# Altium project PCB_Working.PrjPcb
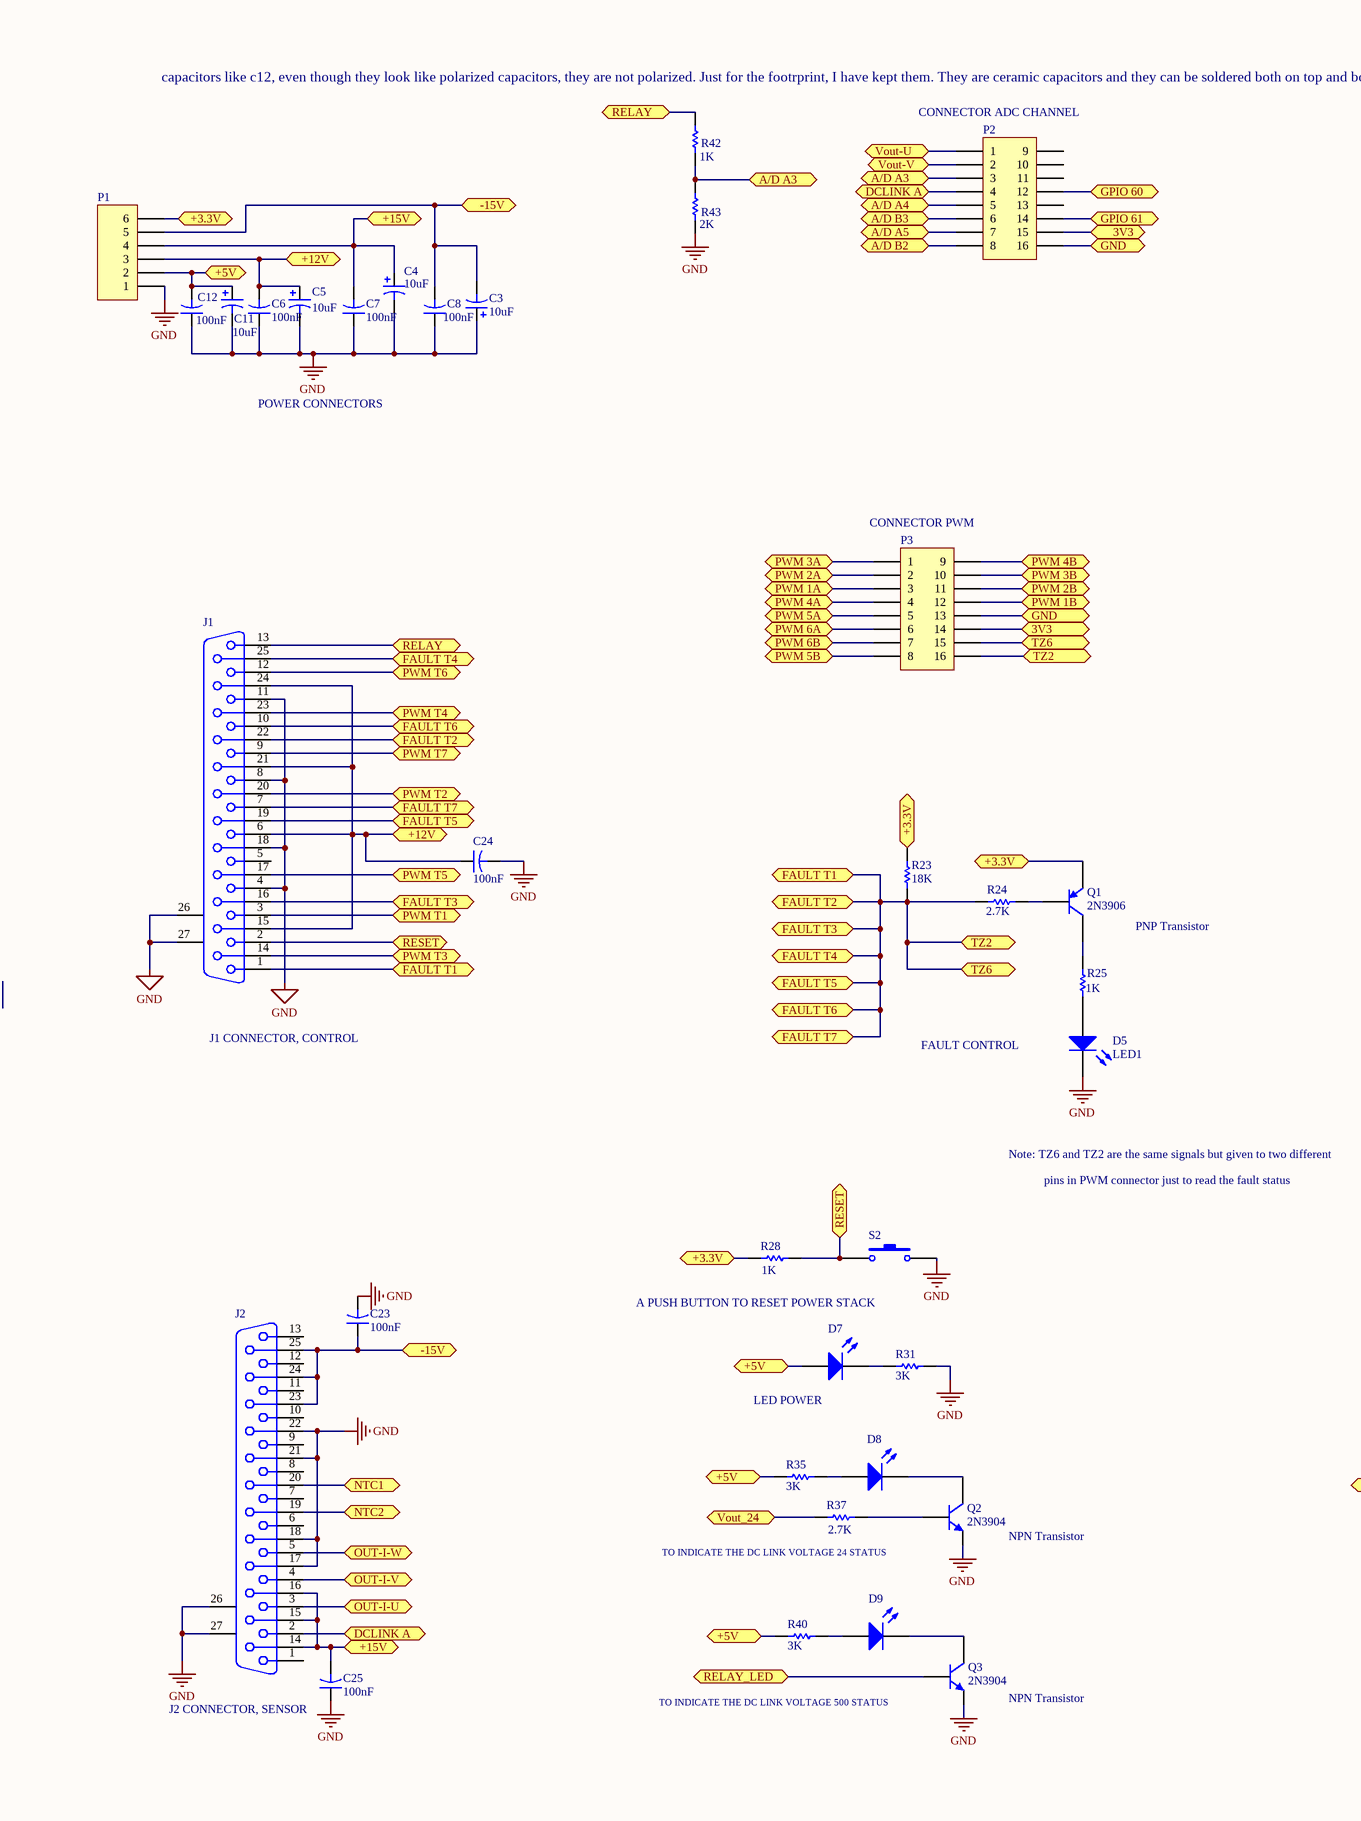
[diagram p0: PCB_Working.SchDoc, left]
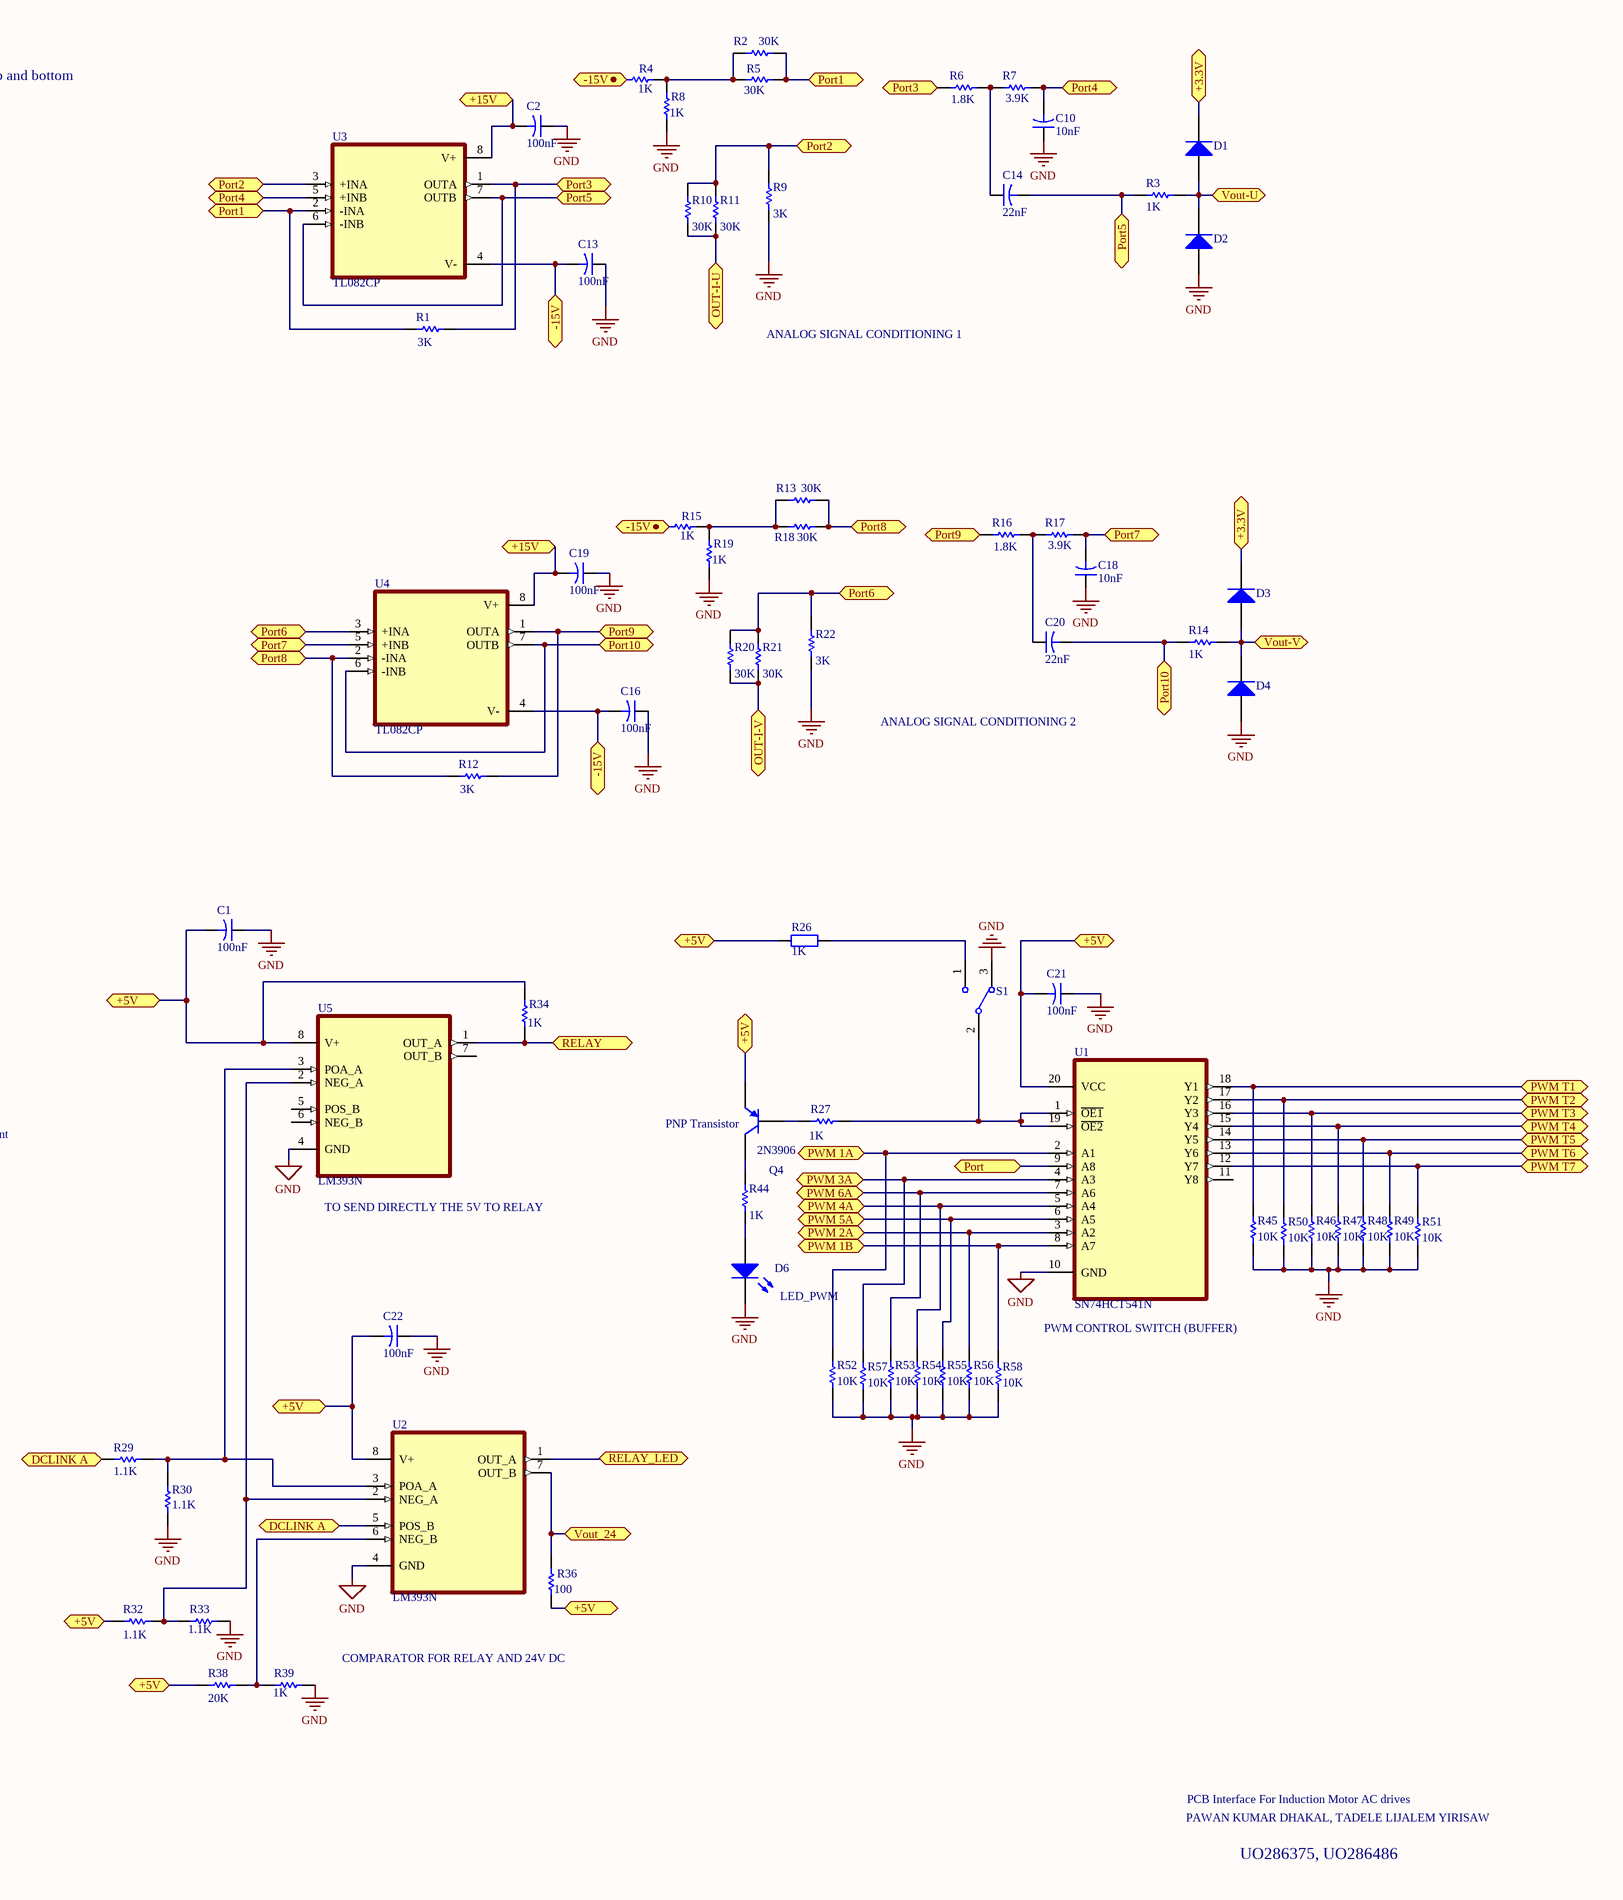
[diagram p1: PCB_Working.SchDoc, right]
1 sheet, 104 parts. Net scope: flat (ports and power ports of the same name join across sheets).
Board file: PCB_Working.PcbDoc

## Sheet PCB_Working.SchDoc
size A2; PageSetup: Record=PageOptions|CenterHorizontal=True|CenterVertical=True|PrintScale=0.73|XCorrection=1.00|YCorrection=1.00|PrintKind=2|BorderSize=5000000|LeftOffset=0|BottomOffset=0|Orientation=2|PaperLength=1000|PaperWidth=1000|Scale=100|PaperSource=7|PrintQuality=-3|MediaType=1|DitherType=10|PrintScaleMode=1|PaperKind=A3|PaperIndex=8

### Parts
C1  value 100nF  [CAPR5-4X5]  (hidden comment: Cap2)
C2  value 100nF  [CAPR5-4X5]  (hidden comment: Cap2)
C3  value 10uF  [RB5-10.5]  (hidden comment: Cap Pol1)
C4  value 10uF  [RB5-10.5]  (hidden comment: Cap Pol1)
C5  value 10uF  [RB5-10.5]  (hidden comment: Cap Pol1)
C6  value 100nF  [CAPR5-4X5]  (hidden comment: Cap2)
C7  value 100nF  [CAPR5-4X5]  (hidden comment: Cap2)
C8  value 100nF  [CAPR5-4X5]  (hidden comment: Cap2)
C10  value 10nF  [CAPR5-4X5]  (hidden comment: Cap2)
C11  value 10uF  [RB5-10.5]  (hidden comment: Cap Pol1)
C12  value 100nF  [CAPR5-4X5]  (hidden comment: Cap2)
C13  value 100nF  [CAPR5-4X5]  (hidden comment: Cap2)
C14  value 22nF  [CAPR5-4X5]  (hidden comment: Cap2)
C16  value 100nF  [CAPR5-4X5]  (hidden comment: Cap2)
C18  value 10nF  [CAPR5-4X5]  (hidden comment: Cap2)
C19  value 100nF  [CAPR5-4X5]  (hidden comment: Cap2)
C20  value 22nF  [CAPR5-4X5]  (hidden comment: Cap2)
C21  value 100nF  [CAPR5-4X5]  (hidden comment: Cap2)
C22  value 100nF  [CAPR5-4X5]  (hidden comment: Cap2)
C23  value 100nF  [CAPR5-4X5]  (hidden comment: Cap2)
C24  value 100nF  [CAPR5-4X5]  (hidden comment: Cap2)
C25  value 100nF  [CAPR5-4X5]  (hidden comment: Cap2)
D1  Diode 1N914  [DO-35]  (value not drawn)
D2  Diode 1N914  [DO-35]  (value not drawn)
D3  Diode 1N914  [DO-35]  (value not drawn)
D4  Diode 1N914  [DO-35]  (value not drawn)
D5  LED1  [LED-1]
D6  LED1  [LED-1]  (value not drawn)
D7  LED1  [LED-1]  (value not drawn)
D8  LED1  [LED-1]  (value not drawn)
D9  LED1  [LED-1]  (value not drawn)
J1  J1 CONNECTOR, CONTROL  [DSUB1.385-2H25A]
J2  J2 CONNECTOR, SENSOR  [DSUB1.385-2H25A]
P1  POWER CONNECTORS  [HDR1X6]
P2  CONNECTOR ADC CHANNEL  [HDR2X8_CEN]
P3  CONNECTOR PWM  [HDR2X8_CEN]
Q1  2N3906  [TO-92A]
Q2  2N3904  [TO-92A]
Q3  2N3904  [TO-92A]
Q4  2N3906  [TO-92A]
R1  value 3K  [AXIAL-0.3]  (hidden comment: Res1)
R2  value 30K  [AXIAL-0.3]  (hidden comment: Res1)
R3  value 1K  [AXIAL-0.3]  (hidden comment: Res1)
R4  value 1K  [AXIAL-0.3]  (hidden comment: Res1)
R5  value 30K  [AXIAL-0.3]  (hidden comment: Res1)
R6  value 1.8K  [AXIAL-0.3]  (hidden comment: Res1)
R7  value 3.9K  [AXIAL-0.3]  (hidden comment: Res1)
R8  value 1K  [AXIAL-0.3]  (hidden comment: Res5)
R9  value 3K  [AXIAL-0.3]  (hidden comment: Res1)
R10  value 30K  [AXIAL-0.3]  (hidden comment: Res1)
R11  value 30K  [AXIAL-0.3]  (hidden comment: Res1)
R12  value 3K  [AXIAL-0.3]  (hidden comment: Res1)
R13  value 30K  [AXIAL-0.3]  (hidden comment: Res1)
R14  value 1K  [AXIAL-0.3]  (hidden comment: Res1)
R15  value 1K  [AXIAL-0.3]  (hidden comment: Res1)
R16  value 1.8K  [AXIAL-0.3]  (hidden comment: Res1)
R17  value 3.9K  [AXIAL-0.3]  (hidden comment: Res1)
R18  value 30K  [AXIAL-0.3]  (hidden comment: Res1)
R19  value 1K  [AXIAL-0.3]  (hidden comment: Res5)
R20  value 30K  [AXIAL-0.3]  (hidden comment: Res1)
R21  value 30K  [AXIAL-0.3]  (hidden comment: Res1)
R22  value 3K  [AXIAL-0.3]  (hidden comment: Res1)
R23  value 18K  [AXIAL-0.3]  (hidden comment: Res1)
R24  value 2.7K  [AXIAL-0.3]  (hidden comment: Res1)
R25  value 1K  [AXIAL-0.3]  (hidden comment: Res1)
R26  value 1K  [AXIAL-0.4]  (hidden comment: Res2)
R27  value 1K  [AXIAL-0.3]  (hidden comment: Res1)
R28  value 1K  [AXIAL-0.3]  (hidden comment: Res1)
R29  value 1.1K  [AXIAL-0.3]  (hidden comment: Res1)
R30  value 1.1K  [AXIAL-0.3]  (hidden comment: Res1)
R31  value 3K  [AXIAL-0.3]  (hidden comment: Res1)
R32  value 1.1K  [AXIAL-0.3]  (hidden comment: Res1)
R33  value 1.1K  [AXIAL-0.3]  (hidden comment: Res1)
R34  value 1K  [AXIAL-0.3]  (hidden comment: Res1)
R35  value 3K  [AXIAL-0.3]  (hidden comment: Res1)
R36  value 100  [AXIAL-0.3]  (hidden comment: Res1)
R37  value 2.7K  [AXIAL-0.3]  (hidden comment: Res1)
R38  value 20K  [AXIAL-0.3]  (hidden comment: Res1)
R39  value 1K  [AXIAL-0.3]  (hidden comment: Res1)
R40  value 3K  [AXIAL-0.3]  (hidden comment: Res1)
R42  value 1K  [AXIAL-0.3]  (hidden comment: Res1)
R43  value 2K  [AXIAL-0.3]  (hidden comment: Res1)
R44  value 1K  [AXIAL-0.3]  (hidden comment: Res1)
R45  value 10K  [AXIAL-0.3]  (hidden comment: Res1)
R46  value 10K  [AXIAL-0.3]  (hidden comment: Res1)
R47  value 10K  [AXIAL-0.3]  (hidden comment: Res1)
R48  value 10K  [AXIAL-0.3]  (hidden comment: Res1)
R49  value 10K  [AXIAL-0.3]  (hidden comment: Res1)
R50  value 10K  [AXIAL-0.3]  (hidden comment: Res1)
R51  value 10K  [AXIAL-0.3]  (hidden comment: Res1)
R52  value 10K  [AXIAL-0.3]  (hidden comment: Res1)
R53  value 10K  [AXIAL-0.3]  (hidden comment: Res1)
R54  value 10K  [AXIAL-0.3]  (hidden comment: Res1)
R55  value 10K  [AXIAL-0.3]  (hidden comment: Res1)
R56  value 10K  [AXIAL-0.3]  (hidden comment: Res1)
R57  value 10K  [AXIAL-0.3]  (hidden comment: Res1)
R58  value 10K  [AXIAL-0.3]  (hidden comment: Res1)
S1  SW-SPDT  [TL36WW15050]  (value not drawn)
S2  SW-PB  [SPST-2]  (value not drawn)
U1  SN74HCT541N  [DIP254P762X508-20]
U2  LM393N  [DIP254P762X508-8]
U3  TL082CP  [DIP794W45P254L959H508Q8]
U4  TL082CP  [DIP794W45P254L959H508Q8]
U5  LM393N  [DIP254P762X508-8]

### Ports
3V3, +3.3V, +5V, +12V, +15V, -15V, A/D A3, A/D A4, A/D A5, A/D B2, A/D B3, DCLINK A, FAULT T1, FAULT T2, FAULT T3, FAULT T4, FAULT T5, FAULT T6, FAULT T7, GND, GPIO 60, GPIO 61, NTC1, NTC2, OUT-I-U, OUT-I-V, OUT-I-W, Port, Port1, Port2, Port3, Port4, Port5, Port6, Port7, Port8, Port9, Port10, PWM 1A, PWM 1B, PWM 2A, PWM 2B, PWM 3A, PWM 3B, PWM 4A, PWM 4B, PWM 5A, PWM 5B, PWM 6A, PWM 6B, PWM T1, PWM T2, PWM T3, PWM T4, PWM T5, PWM T6, PWM T7, RELAY, RELAY_LED, RESET, TZ2, TZ6, Vout-U, Vout-V, Vout_24

### Nets
GND: C1.1 C2.1 C3.1 C4.2 C5.2 C6.1 C7.1 C8.1 C10.1 C11.2 C12.1 C13.1 C16.1 C18.1 C19.1 C21.1 C22.1 C23.2 C24.2 C25.1 D2.1(A) D4.1(A) D5.2(K) D6.2(K) J1.4 J1.8 J1.11 J1.18 J1.26(MH1) J1.27(MH2) J2.17 J2.18 J2.21 J2.22 J2.26(MH1) J2.27(MH2) P1.1 Q2.1(E) Q3.1(E) R8.1 R9.2 R19.1 R22.2 R30.1 R31.1 R33.1 R39.1 R43.1 R45.2 R46.2 R47.2 R48.2 R49.2 R50.2 R51.2 R52.2 R53.2 R54.2 R55.2 R56.2 R57.2 R58.2 S1.3 S2.2 U1.10(GND) U2.4(GND) U5.4(GND)
NetC1_2: C1.2 C11.1 C12.2 C21.2 C22.2 D7.1(A) P1.2 Q4.1(E) R26.2 R32.2 R34.1 R35.2 R36.1 R38.2 R40.2 U1.20(VCC) U2.8(V+) U5.8(V+) ; port +5V
NetC2_2: C2.2 C4.1 C7.2 C19.2 C25.2 J2.14 J2.15 J2.16 P1.4 U3.8(V+) U4.8(V+) ; port +15V
NetC3_2: C3.2 C8.2 C13.2 C16.2 C23.1 J2.23 J2.24 J2.25 P1.5 U3.4(V-) U4.4(V-) ; port -15V
NetC5_1: C5.1 C6.2 C24.1 J1.6 J1.15 J1.21 J1.24 P1.3 ; port +12V
NetC10_2: C10.2 R7.1 U3.5(+INB) ; port Port4
NetC14_1: C14.1 R6.1 R7.2
NetC14_2: C14.2 R3.1 U3.6(-INB) U3.7(OUTB) ; port Port5
NetC18_2: C18.2 R17.1 U4.5(+INB) ; port Port7
NetC20_1: C20.1 R16.1 R17.2
NetC20_2: C20.2 R14.1 U4.6(-INB) U4.7(OUTB) ; port Port10
NetD1_1: D1.1(A) D2.2(K) P2.1 R3.2 ; port Vout-U
NetD1_2: D1.2(K) D3.2(K) P1.6 Q1.1(E) R23.2 R28.1 ; port +3.3V
NetD3_1: D3.1(A) D4.2(K) P2.2 R14.2 ; port Vout-V
NetD5_1: D5.1(A) R25.1
NetD6_1: D6.1(A) R44.2
NetD7_2: D7.2(K) R31.2
NetD8_1: D8.1(A) R35.1
NetD8_2: D8.2(K) Q2.3(C)
NetD9_1: D9.1(A) R40.1
NetD9_2: D9.2(K) Q3.3(C)
NetJ1_1: J1.1 J1.7 J1.10 J1.16 J1.19 J1.22 J1.25 P3.15 P3.16 R23.1 R24.1 ; port FAULT T4, port FAULT T6, port FAULT T2, port FAULT T7, port FAULT T5, port FAULT T3, port FAULT T1, port TZ2, port TZ6
NetJ1_2: J1.2 R28.2 S2.1 ; port RESET
NetJ1_3: J1.3 R45.1 U1.18(Y1) ; port PWM T1
NetJ1_9: J1.9 R51.1 U1.12(Y7) ; port PWM T7
NetJ1_12: J1.12 R49.1 U1.13(Y6) ; port PWM T6
NetJ1_13: J1.13 R34.2 R42.2 U5.1(OUT_A) ; port RELAY
NetJ1_14: J1.14 R46.1 U1.16(Y3) ; port PWM T3
NetJ1_17: J1.17 R48.1 U1.14(Y5) ; port PWM T5
NetJ1_20: J1.20 R50.1 U1.17(Y2) ; port PWM T2
NetJ1_23: J1.23 R47.1 U1.15(Y4) ; port PWM T4
NetJ2_2: J2.2 P2.4 R29.1 U2.5(POS_B) ; port DCLINK A
NetJ2_3: J2.3 R10.2 R11.2 ; port OUT-I-U
NetJ2_4: J2.4 R20.2 R21.2 ; port OUT-I-V
NetJ2_5: J2.5 ; port OUT-I-W
NetJ2_19: J2.19 ; port NTC2
NetJ2_20: J2.20 ; port NTC1
NetP2_3: P2.3 R42.1 R43.2 ; port A/D A3
NetP2_5: P2.5 ; port A/D A4
NetP2_6: P2.6 ; port A/D B3
NetP2_7: P2.7 ; port A/D A5
NetP2_8: P2.8 ; port A/D B2
NetP2_12: P2.12 ; port GPIO 60
NetP2_14: P2.14 ; port GPIO 61
NetP2_15: P2.15 P3.14 ; port 3V3
NetP2_16: P2.16 P3.13 ; port GND
NetP3_1: P3.1 R57.1 U1.4(A3) ; port PWM 3A
NetP3_2: P3.2 R56.1 U1.3(A2) ; port PWM 2A
NetP3_3: P3.3 R52.1 U1.2(A1) ; port PWM 1A
NetP3_4: P3.4 R54.1 U1.5(A4) ; port PWM 4A
NetP3_5: P3.5 R55.1 U1.6(A5) ; port PWM 5A
NetP3_6: P3.6 R53.1 U1.7(A6) ; port PWM 6A
NetP3_7: P3.7 ; port PWM 6B
NetP3_8: P3.8 ; port PWM 5B
NetP3_9: P3.9 ; port PWM 4B
NetP3_10: P3.10 ; port PWM 3B
NetP3_11: P3.11 ; port PWM 2B
NetP3_12: P3.12 R58.1 U1.8(A7) ; port PWM 1B
NetQ1_2: Q1.2(B) R24.2
NetQ1_3: Q1.3(C) R25.2
NetQ2_2: Q2.2(B) R37.2
NetQ3_2: Q3.2(B) U2.1(OUT_A) ; port RELAY_LED
NetQ4_2: Q4.2(B) R27.1
NetQ4_3: Q4.3(C) R44.1
NetR1_1: R1.1 R6.2 U3.1(OUTA) ; port Port3
NetR1_2: R1.2 R2.1 R5.1 U3.2(-INA) ; port Port1
NetR2_2: R2.2 R4.2 R5.2 R8.2
NetR9_1: R9.1 R10.1 R11.1 U3.3(+INA) ; port Port2
NetR12_1: R12.1 R16.2 U4.1(OUTA) ; port Port9
NetR12_2: R12.2 R13.1 R18.1 U4.2(-INA) ; port Port8
NetR13_2: R13.2 R15.2 R18.2 R19.2
NetR20_1: R20.1 R21.1 R22.1 U4.3(+INA) ; port Port6
NetR26_1: R26.1 S1.1
NetR27_2: R27.2 S1.2 U1.1(~{OE1}) U1.19(~{OE2})
NetR29_2: R29.2 R30.2 U2.3(POA_A) U5.3(POA_A)
NetR32_1: R32.1 R33.2 U2.2(NEG_A) U5.2(NEG_A)
NetR36_2: R36.2 R37.1 U2.7(OUT_B) ; port Vout_24
NetR38_1: R38.1 R39.2 U2.6(NEG_B)
NetU1_9: U1.9(A8) ; port Port

Not connected (* = marked no-connect by the designer): J1 5; J2 1 6 7 8 9 10 11 12 13; P2 9 10 11 13; R4 1; R15 1; U1 11(Y8); U5 5(POS_B) 6(NEG_B) 7(OUT_B)

### Notes on the sheet
- (near R42) capacitors like c12, even though they look like polarized capacitors, they are not polarized. Just for the footrprint, I have kept them. They are ceramic capacitors and they can be soldered both on top and bottom
- ANALOG SIGNAL CONDITIONING 1
- ANALOG SIGNAL CONDITIONING 2
- PNP Transistor
- FAULT CONTROL
- Note: TZ6 and TZ2 are the same signals but given to two different
- pins in PWM connector just to read the fault status
- (near Q4) PNP Transistor
- TO SEND DIRECTLY THE 5V TO RELAY
- A PUSH BUTTON TO RESET POWER STACK
- LED_PWM
- PWM CONTROL SWITCH (BUFFER)
- (near D7) LED POWER
- (near R37) TO INDICATE THE DC LINK VOLTAGE 24 STATUS
- (near Q2) NPN Transistor
- TO INDICATE THE DC LINK VOLTAGE 500 STATUS
- (near Q3) NPN Transistor
- COMPARATOR FOR RELAY AND 24V DC
- PAWAN KUMAR DHAKAL, TADELE LIJALEM YIRISAW
- PCB Interface For Induction Motor AC drives
- UO286375, UO286486

### Library data of the parts
C1 C2 C6-C8 C10 C12-C14 C16 C18-C25 = Cap2: Capacitor; Published: 23-Sep-2002; PackageReference: CAPR5-4X5; Publisher: Altium Limited; PackageDescription: Capacitor; 2 Leads
C3-C5 C11 = Cap Pol1: Polarized Capacitor (Radial); Published: 8-Jun-2000; LatestRevisionDate: 17-Jul-2002; LatestRevisionNote: Re-released for DXP Platform.; PackageReference: RB7.6-15; Publisher: Altium Limited; PackageDescription: Polarized Capacitor (Radial); 2 Leads
D1-D4 = Diode 1N914: High Conductance Fast Diode; Published: 8-Jun-2000; LatestRevisionDate: 17-Jul-2002; LatestRevisionNote: Re-released for DXP Platform.; PackageReference: DO-35; Publisher: Altium Limited; PackageDescription: Diode, Axial; Body 3.8 x 1.9 mm (LxDia. max), Lead Dia. 0.53 mm (max); Code_JEDEC: DO-204-AH; DatasheetVersion: 1997; ComponentLink1Description: Manufacturer Link; ComponentLink1URL: http://www.fairchildsemi.com/; ComponentLink2Description: Datasheet; ComponentLink2URL: http://www.fairchildsemi.com/ds/1N%2F1N4448.pdf
D5-D9 = LED1: Typical RED GaAs LED; Published: 8-Jun-2000; LatestRevisionDate: 08-Jul-2005; LatestRevisionNote: Mech Layer 1 removed.; PackageReference: LED-1; Publisher: Altium Limited; PackageDescription: LED; 2 Leads
J1 J2 = D Connector 25: Receptacle Assembly, 25 Position, Right Angle; PackageDocument: U; Positions: 25; Published: 15-Jun-2001; LatestRevisionDate: 17-Jul-2002; LatestRevisionNote: Re-released for DXP Platform.; DatasheetDocument: 19-Mar-1999; PackageReference: 787202; Publisher: Altium Limited; Orientation: Right Angle; Gender: Receptacle
P1 = Header 6: Header, 6-Pin; LatestRevisionDate: 17-Jul-2002; LatestRevisionNote: Re-released for DXP Platform.; Publisher: Altium Limited
P2 P3 = Header 8X2A: Header, 8-Pin, Dual row; LatestRevisionDate: 17-Jul-2002; LatestRevisionNote: Re-released for DXP Platform.; Publisher: Altium Limited
Q1 Q4 = 2N3906: PNP General Purpose Amplifier; Published: 8-Jun-2000; LatestRevisionDate: 15-Jan-2003; LatestRevisionNote: PCB Footprint 'BCY-W3/D4.7' replaced; DatasheetVersion: 1997; PackageVersion: Sep-1998; PackageReference: TO-92A; Publisher: Altium Limited; PackageDescription: TO, Flat Index; 3 In-Line, Axial Leads; Body Dia. 4.5mm; Leads 0.51 x 0.48 mm (max); ComponentLink1Description: Manufacturer Link; ComponentLink1URL: http://www.fairchildsemi.com/; ComponentLink2Description: Datasheet; ComponentLink2URL: http://www.fairchildsemi.com/ds/2N%2F2N3906.pdf
Q2 Q3 = 2N3904: NPN General Purpose Amplifier; Published: 8-Jun-2000; LatestRevisionDate: 15-Jan-2003; LatestRevisionNote: PCB Footprint 'BCY-W3/D4.7' replaced; DatasheetVersion: 1997; PackageVersion: Sep-1998; PackageReference: TO-92A; Publisher: Altium Limited; PackageDescription: TO, Flat Index; 3 In-Line, Axial Leads; Body Dia. 4.5mm; Leads 0.51 x 0.48 mm (max); ComponentLink1Description: Manufacturer Link; ComponentLink1URL: http://www.fairchildsemi.com/; ComponentLink2Description: Datasheet; ComponentLink2URL: http://www.fairchildsemi.com/ds/2N%2F2N3904.pdf
R1-R25 R27-R40 R42-R58 = Res1: Resistor; Published: 8-Jun-2000; LatestRevisionDate: 17-Jul-2002; LatestRevisionNote: Re-released for DXP Platform.; PackageReference: AXIAL-0.3; Publisher: Altium Limited; PackageDescription: Axial Device, Thru-Hole; 2 Leads; 0.3 in Pin Spacing
R26 = Res2: Resistor; Published: 8-Jun-2000; LatestRevisionDate: 17-Jul-2002; LatestRevisionNote: Re-released for DXP Platform.; PackageReference: AXIAL-0.4; Publisher: Altium Limited; PackageDescription: Axial Device, Thru-Hole; 2 Leads; 0.4 in Pin Spacing
S1 = SW-SPDT: SPDT Subminiature Toggle Switch, Right Angle Mounting, Vertical Actuation; Published: 24-Mar-1999; LatestRevisionDate: 17-Dec-2003; LatestRevisionNote: Schematic revised, PCB Footprint replaced.; PackageReference: TL36WW15050; Publisher: Altium Limited; PackageDescription: Switch; 4 Leads; DatasheetVersion: 05-Dec-2000; ComponentLink1Description: Manufacturer Link; ComponentLink1URL: http://www.apem.com
S2 = SW-PB: Switch; Published: 24-Mar-1999; LatestRevisionDate: 17-Jul-2002; LatestRevisionNote: Re-released for DXP Platform.; PackageReference: SPST-2; Publisher: Altium Limited; PackageDescription: Switch; 2 Leads
U1 = SN74HCT541N: Octal Buffers and Line Drivers With 3-State Outputs 20-PDIP -40 to 85; MF: Texas Instruments; Value: *; Availability: In Stock; SnapEDA_Link: https://www.snapeda.com/parts/SN74HCT541N/Texas+Instruments/view-part/?ref=snap; Check_prices: https://www.snapeda.com/parts/SN74HCT541N/Texas+Instruments/view-part/?ref=eda; Price: None; Package: PDIP-20 Texas Instruments; Purchase-URL: https://pricing.snapeda.com/search/part/SN74HCT541N/?ref=eda; MP: SN74HCT541N
U2 U5 = LM393N: Comparator General Purpose CMOS, DTL, ECL, MOS, Open-Collector, TTL 8-DIP; MF: ON Semiconductor; Package: DIP-8 Fairchild Semiconductor; Value: *; Price: None; MP: LM393N; SnapEDA_Link: https://www.snapeda.com/parts/LM393N/ON%20Semiconductor/view-part/6433/?ref=snap; Availability: Unavailable
U3 U4 = TL082CP: Dual High Slew Rate JFET-Input Operational Amplifier 8-PDIP 0 to 70; MF: Texas Instruments; Value: *; SnapEDA_Link: https://www.snapeda.com/parts/TL082CP/Texas%20Instruments/view-part/854431/?ref=snap; MP: TL082CP; Texas_Instruments-Purchase-URL: https://snapeda.com/shop?store=Texas+Instruments&id=854431; Availability: Warning; Mouser-Purchase-URL: https://snapeda.com/shop?store=Mouser&id=854431; Price: None; DigiKey-Purchase-URL: https://snapeda.com/shop?store=DigiKey&id=854431; Package: PDIP-8 Texas Instruments; BuyPart: https://www.snapeda.com/parts/TL082CP/Texas%20Instruments/view-part/854431/?ref=eda